# Altium schematic sheet expansion_connectors.SchDoc
size A3
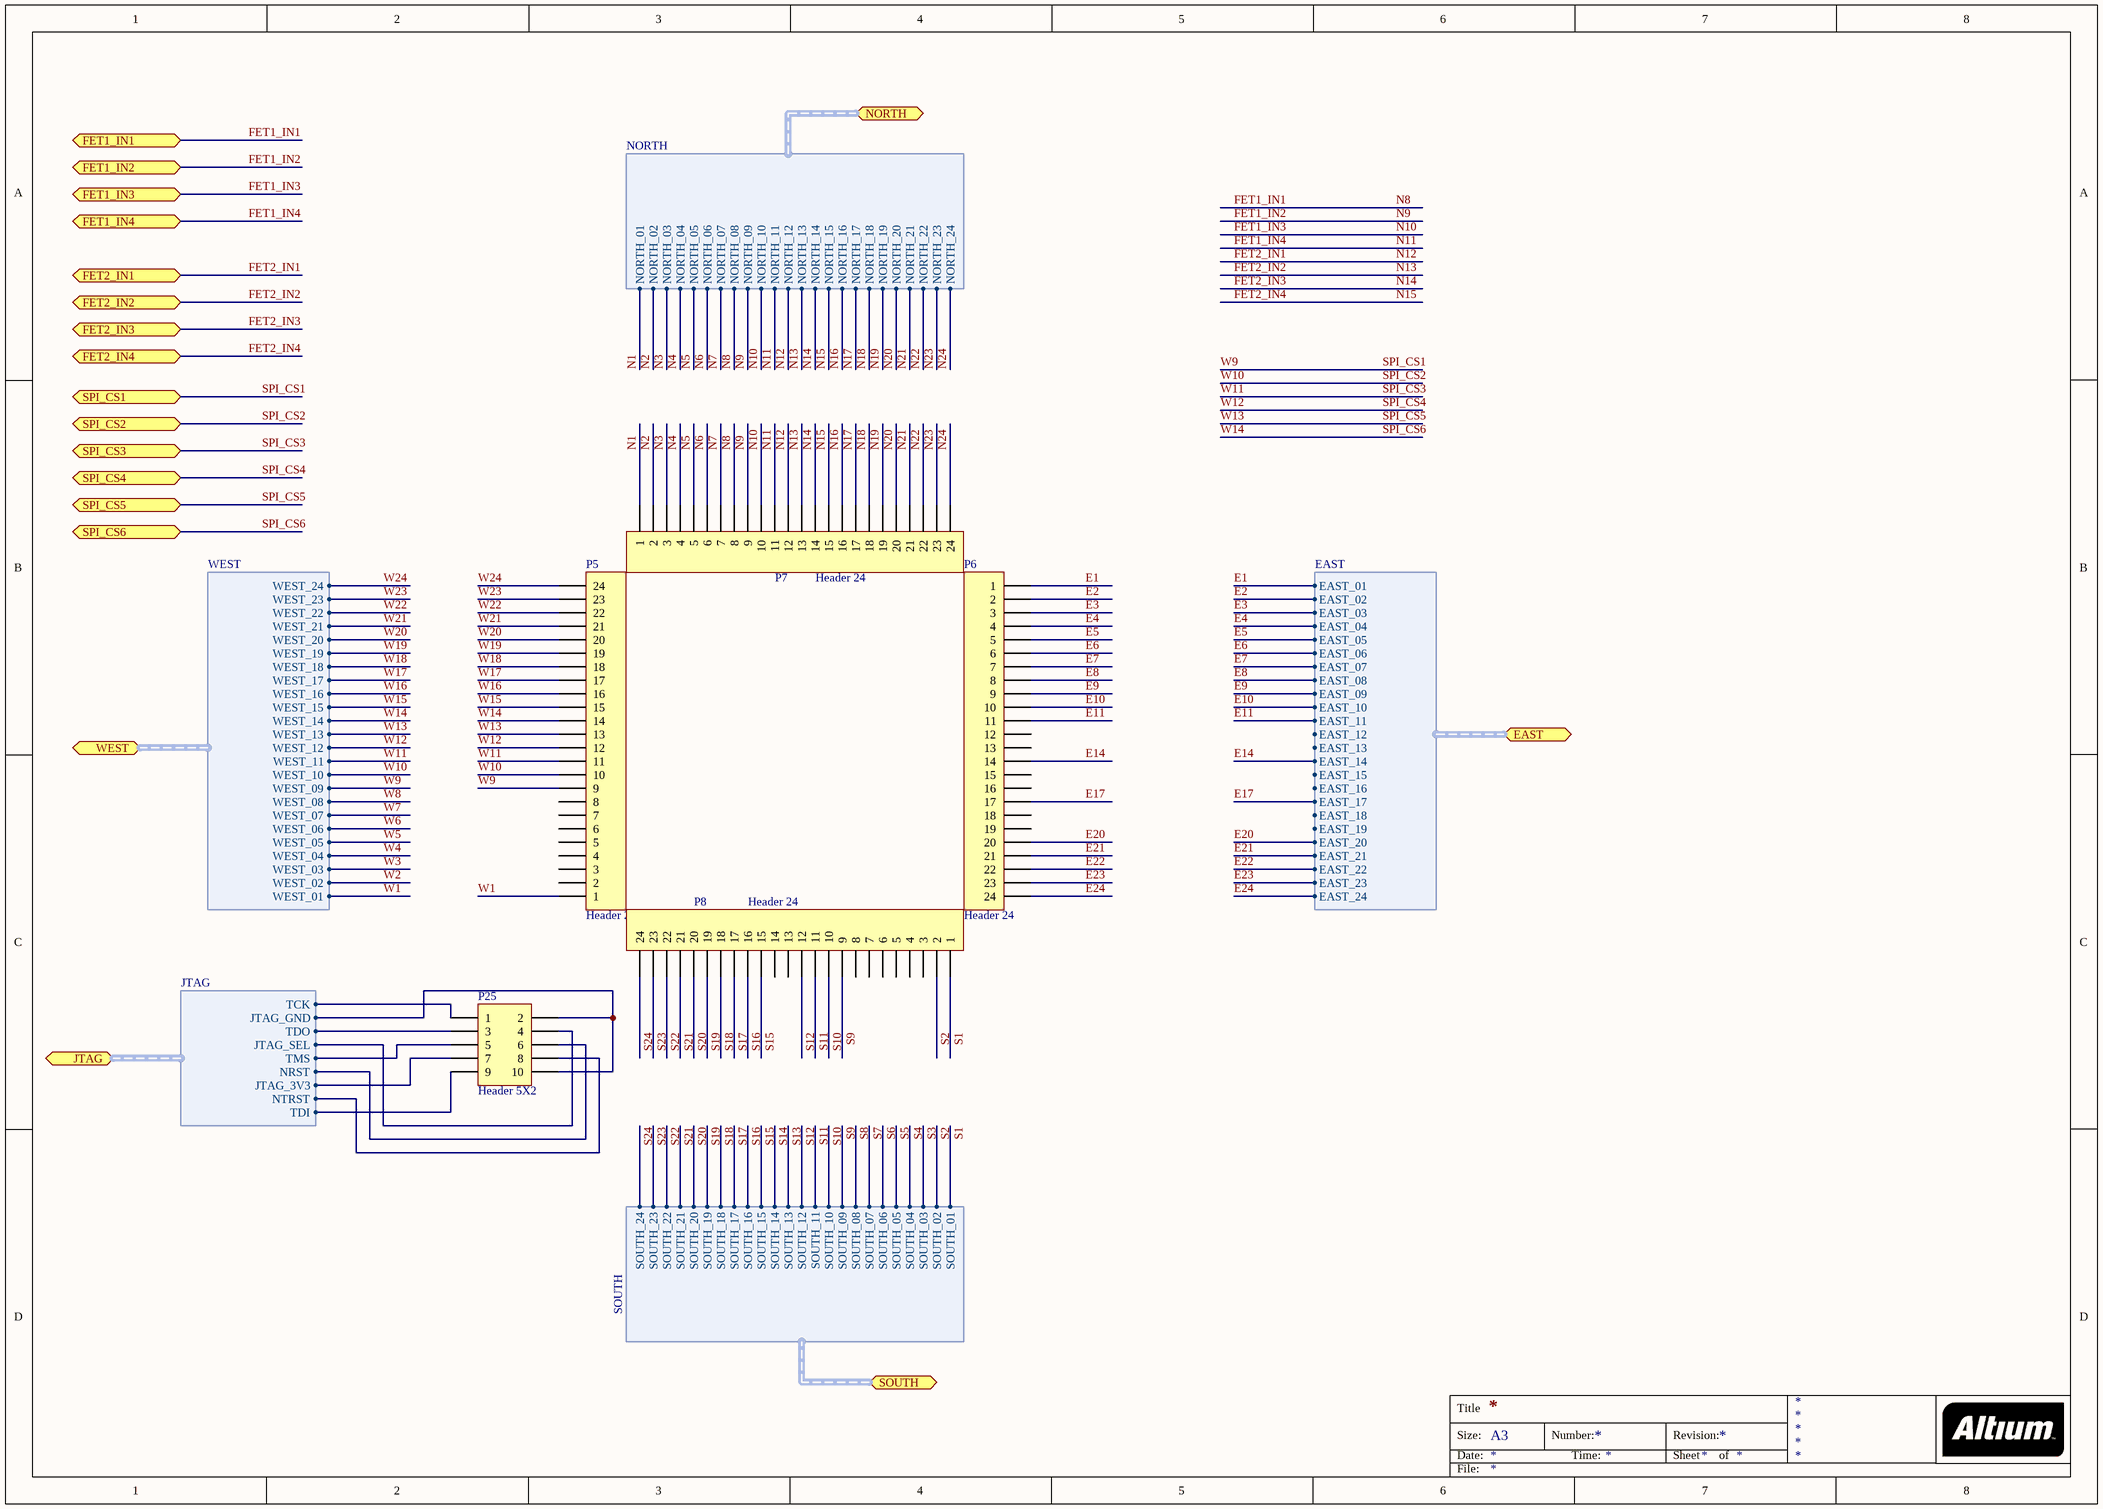
[diagram p0: expansion_connectors.SchDoc]

## Parts
P5  Header 24  [HDR1X24]
P6  Header 24  [HDR1X24]
P7  Header 24  [HDR1X24]
P8  Header 24  [HDR1X24]
P25  Header 5X2  [HDR2X5]

## Ports
EAST (harness EAST), FET1_IN1, FET1_IN2, FET1_IN3, FET1_IN4, FET2_IN1, FET2_IN2, FET2_IN3, FET2_IN4, JTAG (harness JTAG), NORTH (harness NORTH), SOUTH (harness SOUTH), SPI_CS1, SPI_CS2, SPI_CS3, SPI_CS4, SPI_CS5, SPI_CS6, WEST (harness WEST)

## Harnesses
WEST: WEST_01, WEST_02, WEST_03, WEST_04, WEST_05, WEST_06, WEST_07, WEST_08, WEST_09, WEST_10, WEST_11, WEST_12, WEST_13, WEST_14, WEST_15, WEST_16, WEST_17, WEST_18, WEST_19, WEST_20, WEST_21, WEST_22, WEST_23, WEST_24
NORTH: NORTH_01, NORTH_02, NORTH_03, NORTH_04, NORTH_05, NORTH_06, NORTH_07, NORTH_08, NORTH_09, NORTH_10, NORTH_11, NORTH_12, NORTH_13, NORTH_14, NORTH_15, NORTH_16, NORTH_17, NORTH_18, NORTH_19, NORTH_20, NORTH_21, NORTH_22, NORTH_23, NORTH_24
EAST: EAST_01, EAST_02, EAST_03, EAST_04, EAST_05, EAST_06, EAST_07, EAST_08, EAST_09, EAST_10, EAST_11, EAST_12, EAST_13, EAST_14, EAST_15, EAST_16, EAST_17, EAST_18, EAST_19, EAST_20, EAST_21, EAST_22, EAST_23, EAST_24
SOUTH: SOUTH_01, SOUTH_02, SOUTH_03, SOUTH_04, SOUTH_05, SOUTH_06, SOUTH_07, SOUTH_08, SOUTH_09, SOUTH_10, SOUTH_11, SOUTH_12, SOUTH_13, SOUTH_14, SOUTH_15, SOUTH_16, SOUTH_17, SOUTH_18, SOUTH_19, SOUTH_20, SOUTH_21, SOUTH_22, SOUTH_23, SOUTH_24
JTAG: TCK, JTAG_GND, TDO, JTAG_SEL, TMS, NRST, JTAG_3V3, NTRST, TDI

## Nets
E1: P6.1 ; port EAST.EAST_01
E2: P6.2 ; port EAST.EAST_02
E3: P6.3 ; port EAST.EAST_03
E4: P6.4 ; port EAST.EAST_04
E5: P6.5 ; port EAST.EAST_05
E6: P6.6 ; port EAST.EAST_06
E7: P6.7 ; port EAST.EAST_07
E8: P6.8 ; port EAST.EAST_08
E9: P6.9 ; port EAST.EAST_09
E10: P6.10 ; port EAST.EAST_10
E11: P6.11 ; port EAST.EAST_11
E14: P6.14 ; port EAST.EAST_14
E17: P6.17 ; port EAST.EAST_17
E20: P6.20 ; port EAST.EAST_20
E21: P6.21 ; port EAST.EAST_21
E22: P6.22 ; port EAST.EAST_22
E23: P6.23 ; port EAST.EAST_23
E24: P6.24 ; port EAST.EAST_24
FET1_IN1: P7.8 ; port FET1_IN1, port NORTH.NORTH_08  [also labelled N8]
FET1_IN2: P7.9 ; port FET1_IN2, port NORTH.NORTH_09  [also labelled N9]
FET1_IN3: P7.10 ; port FET1_IN3, port NORTH.NORTH_10  [also labelled N10]
FET1_IN4: P7.11 ; port FET1_IN4, port NORTH.NORTH_11  [also labelled N11]
FET2_IN1: P7.12 ; port FET2_IN1, port NORTH.NORTH_12  [also labelled N12]
FET2_IN2: P7.13 ; port FET2_IN2, port NORTH.NORTH_13  [also labelled N13]
FET2_IN3: P7.14 ; port FET2_IN3, port NORTH.NORTH_14  [also labelled N14]
FET2_IN4: P7.15 ; port FET2_IN4, port NORTH.NORTH_15  [also labelled N15]
N1: P7.1 ; port NORTH.NORTH_01
N2: P7.2 ; port NORTH.NORTH_02
N3: P7.3 ; port NORTH.NORTH_03
N4: P7.4 ; port NORTH.NORTH_04
N5: P7.5 ; port NORTH.NORTH_05
N6: P7.6 ; port NORTH.NORTH_06
N7: P7.7 ; port NORTH.NORTH_07
N16: P7.16 ; port NORTH.NORTH_16
N17: P7.17 ; port NORTH.NORTH_17
N18: P7.18 ; port NORTH.NORTH_18
N19: P7.19 ; port NORTH.NORTH_19
N20: P7.20 ; port NORTH.NORTH_20
N21: P7.21 ; port NORTH.NORTH_21
N22: P7.22 ; port NORTH.NORTH_22
N23: P7.23 ; port NORTH.NORTH_23
N24: P7.24 ; port NORTH.NORTH_24
S1: P8.1 ; port SOUTH.SOUTH_01
S2: P8.2 ; port SOUTH.SOUTH_02
S3: port SOUTH.SOUTH_03
S4: port SOUTH.SOUTH_04
S5: port SOUTH.SOUTH_05
S6: port SOUTH.SOUTH_06
S7: port SOUTH.SOUTH_07
S8: port SOUTH.SOUTH_08
S9: P8.9 ; port SOUTH.SOUTH_09
S10: P8.10 ; port SOUTH.SOUTH_10
S11: P8.11 ; port SOUTH.SOUTH_11
S12: P8.12 ; port SOUTH.SOUTH_12
S13: port SOUTH.SOUTH_13
S14: port SOUTH.SOUTH_14
S15: P8.15 ; port SOUTH.SOUTH_15
S16: P8.16 ; port SOUTH.SOUTH_16
S17: P8.17 ; port SOUTH.SOUTH_17
S18: P8.18 ; port SOUTH.SOUTH_18
S19: P8.19 ; port SOUTH.SOUTH_19
S20: P8.20 ; port SOUTH.SOUTH_20
S21: P8.21 ; port SOUTH.SOUTH_21
S22: P8.22 ; port SOUTH.SOUTH_22
S23: P8.23 ; port SOUTH.SOUTH_23
S24: P8.24 ; port SOUTH.SOUTH_24
SPI_CS1: P5.9 ; port SPI_CS1, port WEST.WEST_09  [also labelled W9]
SPI_CS2: P5.10 ; port SPI_CS2, port WEST.WEST_10  [also labelled W10]
SPI_CS3: P5.11 ; port SPI_CS3, port WEST.WEST_11  [also labelled W11]
SPI_CS4: P5.12 ; port SPI_CS4, port WEST.WEST_12  [also labelled W12]
SPI_CS5: P5.13 ; port SPI_CS5, port WEST.WEST_13  [also labelled W13]
SPI_CS6: P5.14 ; port SPI_CS6, port WEST.WEST_14  [also labelled W14]
W1: P5.1 ; port WEST.WEST_01
W2: port WEST.WEST_02
W3: port WEST.WEST_03
W4: port WEST.WEST_04
W5: port WEST.WEST_05
W6: port WEST.WEST_06
W7: port WEST.WEST_07
W8: port WEST.WEST_08
W15: P5.15 ; port WEST.WEST_15
W16: P5.16 ; port WEST.WEST_16
W17: P5.17 ; port WEST.WEST_17
W18: P5.18 ; port WEST.WEST_18
W19: P5.19 ; port WEST.WEST_19
W20: P5.20 ; port WEST.WEST_20
W21: P5.21 ; port WEST.WEST_21
W22: P5.22 ; port WEST.WEST_22
W23: P5.23 ; port WEST.WEST_23
W24: P5.24 ; port WEST.WEST_24
NetP25_1: P25.1 ; port JTAG.TCK
NetP25_2: P25.2 P25.10 ; port JTAG.JTAG_GND
NetP25_3: P25.3 ; port JTAG.TDO
NetP25_4: P25.4 ; port JTAG.JTAG_SEL
NetP25_5: P25.5 ; port JTAG.TMS
NetP25_6: P25.6 ; port JTAG.NRST
NetP25_7: P25.7 ; port JTAG.JTAG_3V3
NetP25_8: P25.8 ; port JTAG.NTRST
NetP25_9: P25.9 ; port JTAG.TDI

Not connected (* = marked no-connect by the designer): P5 2 3 4 5 6 7 8; P6 12 13 15 16 18 19; P8 3 4 5 6 7 8 13 14

## Notes on the sheet
- Title
- Size:
- Date:
- A3
- Number:
- Time:
- Revision:
- Sheet
- of
- File:

## Library data of the parts
P5-P8 = Header 24: Header, 24-Pin; LatestRevisionDate: 17-Jul-2002; LatestRevisionNote: Re-released for DXP Platform.; Publisher: Altium Limited
P25 = Header 5X2: Header, 5-Pin, Dual row; LatestRevisionDate: 17-Jul-2002; LatestRevisionNote: Re-released for DXP Platform.; Publisher: Altium Limited